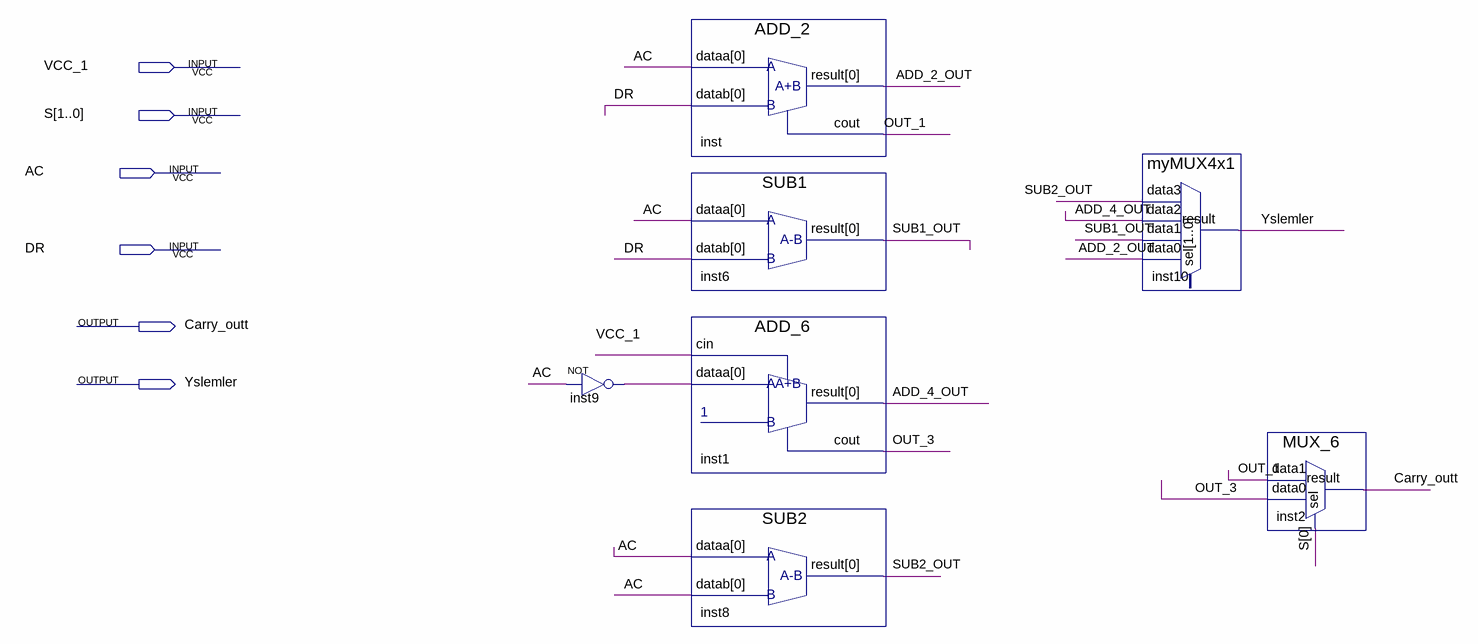
[diagram p0: schematic sheet]
// Quartus schematic Aritmetic.bdf as structural Verilog: 7 symbols, 6 pins
module Aritmetic (
  input  VCC_1,
  input  [1:0] S,
  input  AC,
  input  DR,
  output Carry_outt,
  output Yslemler
);

  wire ADD_2_OUT, ADD_4_OUT, inst9_out, OUT_1, OUT_3, SUB1_OUT, SUB2_OUT;

  not inst9 (inst9_out, AC);
  ADD_2 inst (.dataa(AC), .datab(DR), .result(ADD_2_OUT), .cout(OUT_1));
  SUB1 inst6 (.dataa(AC), .datab(DR), .result(SUB1_OUT));
  ADD_6 inst1 (.cin(VCC_1), .dataa(inst9_out), .result(ADD_4_OUT), .cout(OUT_3));
  SUB2 inst8 (.dataa(AC), .datab(AC), .result(SUB2_OUT));
  myMUX4x1 inst10 (
    .data3(SUB2_OUT), .data2(ADD_4_OUT), .data1(SUB1_OUT), .data0(ADD_2_OUT), .result(Yslemler));  // open: sel
  MUX_6 inst2 (.data1(OUT_1), .data0(OUT_3), .sel(S[0]), .result(Carry_outt));
endmodule
